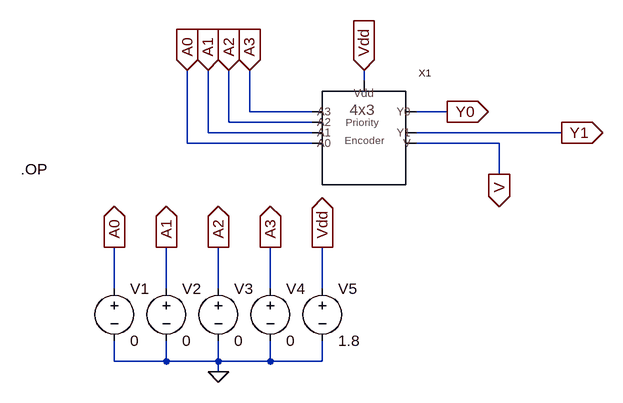
[diagram p0: schematic Draft6.asc]
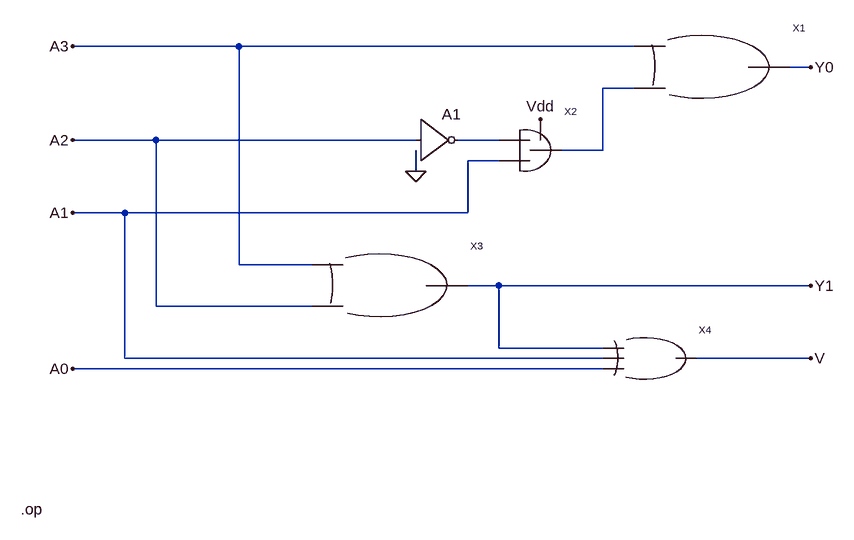
[diagram p1: sub-circuit 4x3priority.asc]
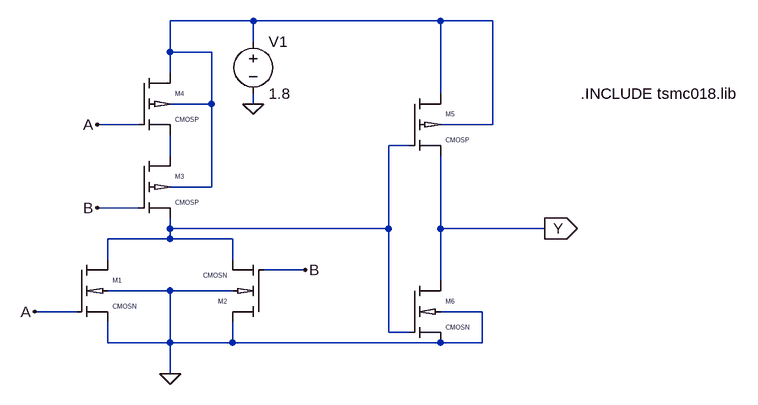
[diagram p2: sub-circuit or.asc]
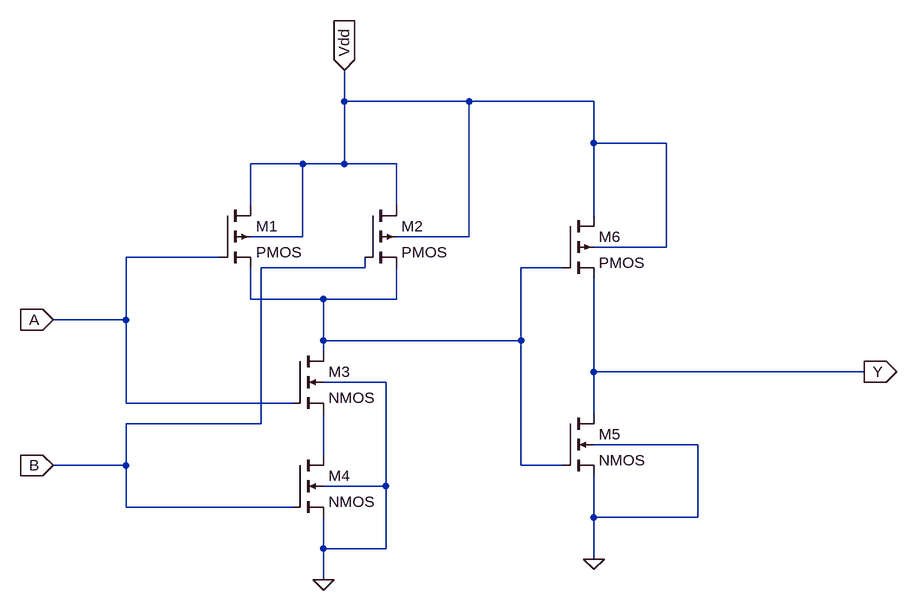
[diagram p3: sub-circuit and.asc]
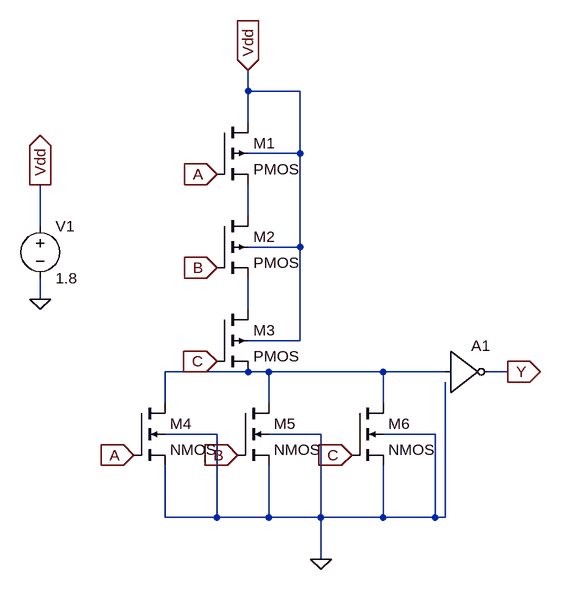
[diagram p4: sub-circuit or3.asc]
Draft6.asc, the LTspice schematic file:
Version 4
SHEET 1 880 688
WIRE 224 80 224 64
WIRE 48 128 48 64
WIRE 144 128 48 128
WIRE 352 128 304 128
WIRE 16 144 16 64
WIRE 144 144 16 144
WIRE -16 160 -16 64
WIRE 144 160 -16 160
WIRE 528 160 304 160
WIRE -48 176 -48 64
WIRE 144 176 -48 176
WIRE 432 176 304 176
WIRE 432 224 432 176
WIRE -160 400 -160 336
WIRE -80 400 -80 336
WIRE 0 400 0 336
WIRE 80 400 80 336
WIRE 160 400 160 336
WIRE -160 512 -160 480
WIRE -80 512 -80 480
WIRE -80 512 -160 512
WIRE 0 512 0 480
WIRE 0 512 -80 512
WIRE 80 512 80 480
WIRE 80 512 0 512
WIRE 160 512 160 480
WIRE 160 512 80 512
WIRE 0 528 0 512
FLAG 48 64 A3
IOPIN 48 64 In
FLAG 16 64 A2
IOPIN 16 64 In
FLAG -16 64 A1
IOPIN -16 64 In
FLAG -48 64 A0
IOPIN -48 64 In
FLAG 224 64 Vdd
IOPIN 224 64 In
FLAG 352 128 Y0
IOPIN 352 128 Out
FLAG 432 224 V
IOPIN 432 224 Out
FLAG 528 160 Y1
IOPIN 528 160 Out
FLAG 0 528 0
FLAG 160 336 Vdd
IOPIN 160 336 Out
FLAG 80 336 A3
IOPIN 80 336 Out
FLAG 0 336 A2
IOPIN 0 336 Out
FLAG -80 336 A1
IOPIN -80 336 Out
FLAG -160 336 A0
IOPIN -160 336 Out
SYMBOL 4x3Priority 224 160 R0
SYMATTR InstName X1
SYMBOL voltage -160 384 R0
WINDOW 123 0 0 Left 0
WINDOW 39 0 0 Left 0
SYMATTR InstName V1
SYMATTR Value 0
SYMBOL voltage -80 384 R0
WINDOW 123 0 0 Left 0
WINDOW 39 0 0 Left 0
SYMATTR InstName V2
SYMATTR Value 0
SYMBOL voltage 0 384 R0
WINDOW 123 0 0 Left 0
WINDOW 39 0 0 Left 0
SYMATTR InstName V3
SYMATTR Value 0
SYMBOL voltage 80 384 R0
WINDOW 123 0 0 Left 0
WINDOW 39 0 0 Left 0
SYMATTR InstName V4
SYMATTR Value 0
SYMBOL voltage 160 384 R0
WINDOW 123 0 0 Left 0
WINDOW 39 0 0 Left 0
SYMATTR InstName V5
SYMATTR Value 1.8
TEXT -304 216 Left 2 !.OP

4x3priority.asc, the sub-circuit schematic file:
Version 4
SHEET 1 880 884
WIRE -176 0 -432 0
WIRE 432 0 -176 0
WIRE 704 32 672 32
WIRE 432 64 384 64
WIRE -304 144 -432 144
WIRE 96 144 -304 144
WIRE 224 144 160 144
WIRE 384 160 384 64
WIRE 384 160 320 160
WIRE 224 176 176 176
WIRE 96 192 96 160
WIRE -352 256 -432 256
WIRE 176 256 176 176
WIRE 176 256 -352 256
WIRE -176 336 -176 0
WIRE -64 336 -176 336
WIRE 224 368 176 368
WIRE 704 368 224 368
WIRE -304 400 -304 144
WIRE -64 400 -304 400
WIRE 224 464 224 368
WIRE 384 464 224 464
WIRE -352 480 -352 256
WIRE 384 480 -352 480
WIRE 704 480 528 480
WIRE 384 496 -432 496
FLAG 96 192 0
FLAG 288 112 Vdd
FLAG 704 32 Y0
FLAG 704 368 Y1
FLAG 704 480 V
FLAG -432 0 A3
FLAG -432 144 A2
FLAG -432 256 A1
FLAG -432 496 A0
SYMBOL Digital\\inv 96 80 R0
SYMATTR InstName A1
SYMBOL OR 544 32 R0
SYMATTR InstName X1
SYMBOL AND 256 176 R0
SYMATTR InstName X2
SYMBOL OR 48 368 R0
SYMATTR InstName X3
SYMBOL OR3 432 480 R0
SYMATTR InstName X4
TEXT -512 712 Left 2 !.op

or.asc, the sub-circuit schematic file:
Version 4
SHEET 1 1052 680
WIRE 288 -208 160 -208
WIRE 576 -208 288 -208
WIRE 656 -208 576 -208
WIRE 288 -176 288 -208
WIRE 160 -160 160 -208
WIRE 224 -160 160 -160
WIRE 160 -128 160 -160
WIRE 576 -96 576 -208
WIRE 224 -80 224 -160
WIRE 224 -80 160 -80
WIRE 288 -80 288 -96
WIRE 112 -48 48 -48
WIRE 656 -48 656 -208
WIRE 656 -48 576 -48
WIRE 528 -16 496 -16
WIRE 160 0 160 -32
WIRE 224 48 224 -80
WIRE 224 48 160 48
WIRE 112 80 48 80
WIRE 160 112 160 96
WIRE 496 112 496 -16
WIRE 496 112 160 112
WIRE 576 112 576 0
WIRE 736 112 576 112
WIRE 160 128 160 112
WIRE 160 128 64 128
WIRE 256 128 160 128
WIRE 64 160 64 128
WIRE 256 160 256 128
WIRE 368 176 304 176
WIRE 576 192 576 112
WIRE 160 208 64 208
WIRE 256 208 160 208
WIRE 16 240 -48 240
WIRE 640 240 576 240
WIRE 496 272 496 112
WIRE 528 272 496 272
WIRE 64 288 64 256
WIRE 160 288 160 208
WIRE 160 288 64 288
WIRE 256 288 256 256
WIRE 256 288 160 288
WIRE 576 288 256 288
WIRE 640 288 640 240
WIRE 640 288 576 288
WIRE 160 336 160 288
FLAG 160 336 0
FLAG 288 -80 0
FLAG 48 -48 A
FLAG -48 240 A
FLAG 48 80 B
FLAG 368 176 B
FLAG 736 112 Y
IOPIN 736 112 Out
SYMBOL Ncmos 16 160 R0
SYMATTR InstName M1
SYMATTR Value2 l=180n w=360n
SYMBOL Ncmos 304 256 R180
SYMATTR InstName M2
SYMATTR Value2 l=180n w=360n
SYMBOL Pcmos 112 0 R0
SYMATTR InstName M3
SYMATTR Value2 l=180n w=360n
SYMBOL Pcmos 112 -128 R0
SYMATTR InstName M4
SYMATTR Value2 l=180n w=360n
SYMBOL voltage 288 -192 R0
WINDOW 123 0 0 Left 0
WINDOW 39 0 0 Left 0
SYMATTR InstName V1
SYMATTR Value 1.8
SYMBOL Pcmos 528 -96 R0
SYMATTR InstName M5
SYMATTR Value2 l=180n w=360n
SYMBOL Ncmos 528 192 R0
SYMATTR InstName M6
SYMATTR Value2 l=180n w=360n
TEXT 792 -96 Left 2 !.INCLUDE tsmc018.lib

and.asc, the sub-circuit schematic file:
Version 4
SHEET 1 1100 680
WIRE 224 -112 224 -160
WIRE 416 -112 224 -112
WIRE 608 -112 416 -112
WIRE 608 -48 608 -112
WIRE 720 -48 608 -48
WIRE 160 -16 80 -16
WIRE 224 -16 224 -112
WIRE 224 -16 160 -16
WIRE 304 -16 224 -16
WIRE 80 48 80 -16
WIRE 304 48 304 -16
WIRE 608 64 608 -48
WIRE 160 96 160 -16
WIRE 160 96 80 96
WIRE 416 96 416 -112
WIRE 416 96 304 96
WIRE 720 112 720 -48
WIRE 720 112 608 112
WIRE 32 128 -112 128
WIRE 256 144 256 128
WIRE 256 144 96 144
WIRE 560 144 496 144
WIRE 80 192 80 144
WIRE 192 192 80 192
WIRE 304 192 304 144
WIRE 304 192 192 192
WIRE -112 224 -112 128
WIRE -112 224 -224 224
WIRE 192 256 192 192
WIRE 496 256 496 144
WIRE 496 256 192 256
WIRE 192 272 192 256
WIRE 608 304 608 160
WIRE 1024 304 608 304
WIRE 288 320 192 320
WIRE -112 352 -112 224
WIRE 144 352 -112 352
WIRE 608 368 608 304
WIRE 96 384 96 144
WIRE 96 384 -112 384
WIRE 768 416 608 416
WIRE 192 432 192 368
WIRE -112 448 -112 384
WIRE -112 448 -224 448
WIRE 496 448 496 256
WIRE 560 448 496 448
WIRE 288 480 288 320
WIRE 288 480 192 480
WIRE -112 512 -112 448
WIRE 144 512 -112 512
WIRE 608 528 608 464
WIRE 768 528 768 416
WIRE 768 528 608 528
WIRE 192 576 192 528
WIRE 288 576 288 480
WIRE 288 576 192 576
WIRE 608 592 608 528
WIRE 192 624 192 576
FLAG 192 624 0
FLAG -224 224 A
IOPIN -224 224 In
FLAG -224 448 B
IOPIN -224 448 In
FLAG 224 -160 Vdd
IOPIN 224 -160 In
FLAG 608 592 0
FLAG 1024 304 Y
IOPIN 1024 304 Out
SYMBOL pmos4 32 48 R0
SYMATTR InstName M1
SYMBOL nmos4 144 272 R0
SYMATTR InstName M3
SYMBOL nmos4 144 432 R0
SYMATTR InstName M4
SYMBOL nmos4 560 368 R0
SYMATTR InstName M5
SYMBOL pmos4 560 64 R0
SYMATTR InstName M6
SYMBOL pmos4 256 48 R0
SYMATTR InstName M2

or3.asc, the sub-circuit schematic file:
Version 4
SHEET 1 880 692
WIRE 112 -48 112 -80
WIRE 192 -48 112 -48
WIRE 112 0 112 -48
WIRE 192 48 192 -48
WIRE 192 48 112 48
WIRE 112 144 112 96
WIRE -208 160 -208 96
WIRE 192 192 192 48
WIRE 192 192 112 192
WIRE -208 272 -208 240
WIRE 112 288 112 240
WIRE 192 336 192 192
WIRE 192 336 112 336
WIRE 112 384 -16 384
WIRE 144 384 112 384
WIRE 320 384 144 384
WIRE 416 384 320 384
WIRE 512 384 480 384
WIRE -16 432 -16 384
WIRE 144 432 144 384
WIRE 320 432 320 384
WIRE 64 480 -16 480
WIRE 224 480 144 480
WIRE 400 480 320 480
WIRE -16 608 -16 528
WIRE 64 608 64 480
WIRE 64 608 -16 608
WIRE 144 608 144 528
WIRE 144 608 64 608
WIRE 224 608 224 480
WIRE 224 608 144 608
WIRE 320 608 320 528
WIRE 320 608 224 608
WIRE 400 608 400 480
WIRE 400 608 320 608
WIRE 416 608 416 400
WIRE 416 608 400 608
WIRE 224 672 224 608
FLAG 64 80 A
IOPIN 64 80 In
FLAG -64 512 A
IOPIN -64 512 In
FLAG 64 224 B
IOPIN 64 224 In
FLAG 96 512 B
IOPIN 96 512 In
FLAG 64 368 C
IOPIN 64 368 In
FLAG 272 512 C
IOPIN 272 512 In
FLAG 224 672 0
FLAG 512 384 Y
IOPIN 512 384 Out
FLAG -208 272 0
FLAG -208 96 Vdd
IOPIN -208 96 Out
FLAG 112 -80 Vdd
IOPIN 112 -80 In
SYMBOL pmos4 64 0 R0
SYMATTR InstName M1
SYMBOL pmos4 64 144 R0
SYMATTR InstName M2
SYMATTR Value2 l=180n
SYMBOL pmos4 64 288 R0
SYMATTR InstName M3
SYMATTR Value2 l=180n
SYMBOL nmos4 -64 432 R0
SYMATTR InstName M4
SYMATTR Value2 l=180n
SYMBOL nmos4 96 432 R0
SYMATTR InstName M5
SYMATTR Value2 l=180n
SYMBOL nmos4 272 432 R0
SYMATTR InstName M6
SYMATTR Value2 l=180n
SYMBOL voltage -208 144 R0
WINDOW 123 0 0 Left 0
WINDOW 39 0 0 Left 0
SYMATTR InstName V1
SYMATTR Value 1.8
SYMBOL Digital\\inv 416 320 R0
SYMATTR InstName A1

The netlist it stands for:
* Draft6.asc
XX1 Vdd A3 A2 A1 A0 Y0 Y1 V 4x3priority
V1 A0 0 0
V2 A1 0 0
V3 A2 0 0
V4 A3 0 0
V5 Vdd 0 1.8

* block symbol definitions
.subckt 4x3priority Vdd A3 A2 A1 A0 Y0 Y1 V
A1 A2 0 0 0 0 N002 0 0 BUF
XX1 A3 N001 Y0 or
XX2 N002 A1 Vdd N001 and
XX3 A3 A2 Y1 or
XX4 V Y1 A1 A0 or3
.op
.ends 4x3priority

.subckt or A B Y
M1 N002 A 0 0 CMOSN l=180n w=360n
M2 0 B N002 0 CMOSN l=180n w=360n
M3 N003 B N002 N001 CMOSP l=180n w=360n
M4 N001 A N003 N001 CMOSP l=180n w=360n
V1 N001 0 1.8
M5 N001 N002 Y N001 CMOSP l=180n w=360n
M6 Y N002 0 0 CMOSN l=180n w=360n
.INCLUDE tsmc018.lib
.ends or

.subckt and A B Vdd Y
M1 Vdd A N001 Vdd PMOS
M3 N001 A N002 0 NMOS
M4 N002 B 0 0 NMOS
M5 Y N001 0 0 NMOS
M6 Vdd N001 Y Vdd PMOS
M2 Vdd B N001 Vdd PMOS
.ends and

.subckt or3 Y A B C
M1 Vdd A N001 Vdd PMOS
M2 N001 B N002 Vdd PMOS l=180n
M3 N002 C N003 Vdd PMOS l=180n
M4 N003 A 0 0 NMOS l=180n
M5 N003 B 0 0 NMOS l=180n
M6 N003 C 0 0 NMOS l=180n
V1 Vdd 0 1.8
A1 N003 0 0 0 0 Y 0 0 BUF
.ends or3

.model NMOS NMOS
.model PMOS PMOS
.lib standard.mos
.OP
.lib tsmc018.lib
.backanno
.end